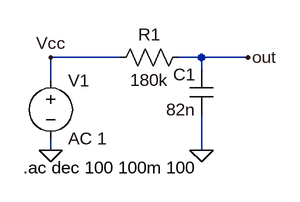
[diagram p0: schematic flilter.asc]
flilter.asc, the LTspice schematic file:
Version 4
SHEET 1 880 680
WIRE 16 128 -80 128
WIRE 128 128 96 128
WIRE 192 128 128 128
WIRE 128 144 128 128
WIRE -80 160 -80 128
WIRE -80 256 -80 240
WIRE 128 256 128 208
FLAG 128 256 0
FLAG -80 256 0
FLAG -80 128 Vcc
FLAG 192 128 out
SYMBOL res 112 112 R90
WINDOW 0 0 56 VBottom 2
WINDOW 3 32 56 VTop 2
SYMATTR InstName R1
SYMATTR Value 180k
SYMBOL cap 144 208 R180
WINDOW 0 24 56 Left 2
WINDOW 3 24 8 Left 2
SYMATTR InstName C1
SYMATTR Value 82n
SYMBOL voltage -80 144 R0
WINDOW 123 0 0 Left 0
WINDOW 39 0 0 Left 0
SYMATTR InstName V1
SYMATTR Value AC 1
TEXT -118 280 Left 2 !.ac dec 100 100m 100

The netlist it stands for:
* flilter.asc
R1 out Vcc 180k
C1 0 out 82n
V1 Vcc 0 AC 1
.ac dec 100 100m 100
.backanno
.end